# EAGLE design BBConnector (EAGLE 6.5.0)
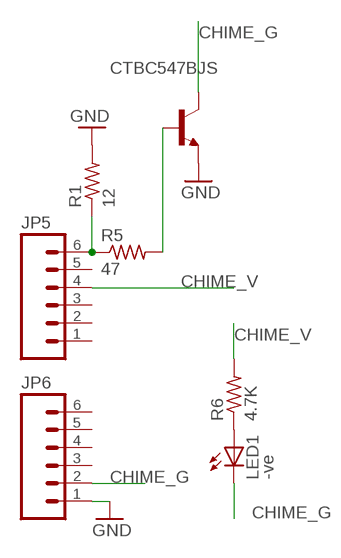
[diagram p0: schematic, sheet 1]

## Parts
CTBC547BJS  2N2222  [TO92-EBC-OVAL]
JP5  M06NO_SILK_YES_STOP  [1X06_NO_SILK_YES_STOP]
JP6  M06NO_SILK_YES_STOP  [1X06_NO_SILK_YES_STOP]
LED1  -ve  LEDCHIP-LED0603  [CHIP-LED0603]
R1  12  R-US_R0603  [R0603]
R5  47  R-US_R0603  [R0603]
R6  4.7K  R-US_R0603  [R0603]

## Nets
CHIME_G: CTBC547BJS.C JP6.2 LED1.C
CHIME_V: JP5.4 R6.2
GND: CTBC547BJS.E JP6.1 R1.2
N$1: JP5.6 R1.1 R5.1
N$2: LED1.A R6.1
N$3: CTBC547BJS.B R5.2
Unconnected: JP5.1 JP5.2 JP5.3 JP5.5 JP6.3 JP6.4 JP6.5 JP6.6

## Library data of the parts
CTBC547BJS = adafruit:2N2222: NPN TRANSISTOR Big oval pads
JP5 JP6 = SparkFun-Connectors:M06: Header 6 Standard 6-pin 0.1" header. Use with straight break away headers (SKU : PRT-00116), right angle break away headers (PRT-00553), swiss pins (PRT-00743), machine pins (PRT-00117), and female headers (PRT-00115). Molex polarized connector foot print use with SKU : PRT-08094 with associated crimp pins and housings. NOTES ON THE VARIANTS LOCK and LOCK_LONGPADS... This footprint was designed to help hold the alignment of a through-hole component (i.e. 6-pin header) while soldering it into place. You may notice that each hole has been shifted either up or down by 0.005 of an inch from it's more standard position (which is a perfectly straight line). This slight alteration caused the pins (the squares in the middle) to touch the edges of the holes. Because they are alternating, it causes a "brace" to hold the component in place. 0.005 has proven to be the perfect amount of "off-center" position when using our standard breakaway headers. Although looks a little odd when you look at the bare footprint, once you have a header in there, the alteration is very hard to notice. Also,if you push a header all the way into place, it is covered up entirely on the bottom side. This idea of altering the position of holes to aid alignment will be further integrated into the Sparkfun Library for other footprints. It can help hold any component with 3 or more connection pins.
LED1 = adafruit:LED: LED OSRAM: - CHIPLED LG R971, LG N971, LY N971, LG Q971, LY Q971, LO R971, LY R971 LH N974, LH R974 LS Q976, LO Q976, LY Q976 LO Q996 - Hyper CHIPLED LW Q18S LB Q993, LB Q99A, LB R99A - SideLED LS A670, LO A670, LY A670, LG A670, LP A670 LB A673, LV A673, LT A673, LW A673 LH A674 LY A675 LS A676, LA A676, LO A676, LY A676, LW A676 LS A679, LY A679, LG A679 - Hyper Micro SIDELED® LS Y876, LA Y876, LO Y876, LY Y876 LT Y87S - SmartLED LW L88C, LW L88S LB L89C, LB L89S, LG L890 LS L89K, LO L89K, LY L89K LS L896, LA L896, LO L896, LY L896 - TOPLED LS T670, LO T670, LY T670, LG T670, LP T670 LSG T670, LSP T670, LSY T670, LOP T670, LYG T670 LG T671, LOG T671, LSG T671 LB T673, LV T673, LT T673, LW T673 LH T674 LS T676, LA T676, LO T676, LY T676, LB T676, LH T676, LSB T676, LW T676 LB T67C, LV T67C, LT T67C, LS T67K, LO T67K, LY T67K, LW E67C LS E67B, LA E67B, LO E67B, LY E67B, LB E67C, LV E67C, LT E67C LW T67C LS T679, LY T679, LG T679 LS T770, LO T770, LY T770, LG T770, LP T770 LB T773, LV T773, LT T773, LW T773 LH T774 LS E675, LA E675, LY E675, LS T675 LS T776, LA T776, LO T776, LY T776, LB T776 LHGB T686 LT T68C, LB T68C - Hyper Mini TOPLED® LB M676 - Mini TOPLED Santana® LG M470 LS M47K, LO M47K, LY M47K Source: http://www.osram.convergy.de/
R1 R5 R6 = adafruit:R-US_: RESISTOR, American symbol

## Board
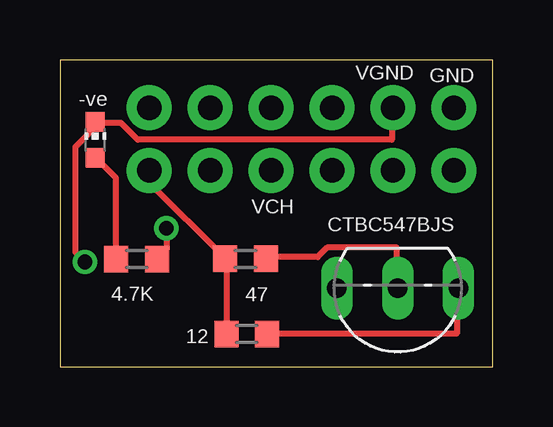
[diagram p1: board, top side]
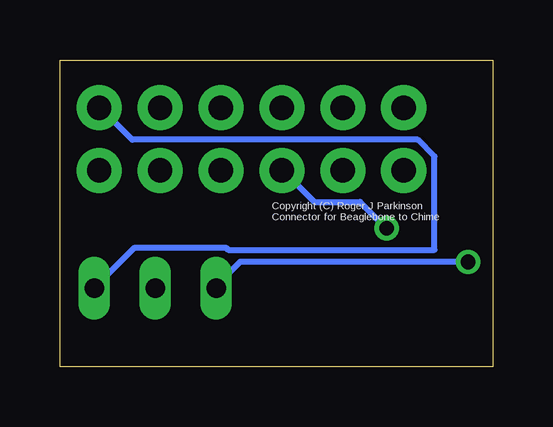
[diagram p2: board, bottom side, seen from below]

Size 18.06 x 12.8 mm. Coordinates in mm from the lower left corner, seen from the top.
Outline: 0,0 18.06,0.01 18.06,12.8 0,12.81 0,0
Copper layers (1*16): Top 0.035mm / dielectric 1.5mm / Bottom 0.035mm
Design rules "default": minimum track width 10mil, minimum drill 24mil, track to track 8mil, track to pad 8mil, pad to pad 8mil, via to via 8mil, smd to smd 8mil, copper to edge 40mil, drill to drill 8mil, minimum pad ring 10mil, minimum via ring 8mil, stop-mask expansion 4mil, vias tented up to drill 0mil, thermal gap 10mil

### Footprints (pad centres in the part's own frame; a part is rotated, then mirrored left to right if it is on the bottom)
TO92-EBC-OVAL = drill 0.813 long: B 0,-1.27; C 2.54,-1.27; E -2.54,-1.27
1X06_NO_SILK_YES_STOP = drill 1.016 pad 1.88: 1 0,0; 2 2.54,0; 3 5.08,0; 4 7.62,0; 5 10.16,0; 6 12.7,0
CHIP-LED0603 = smd 0.8 x 0.8: A 0,-0.75; C 0,0.75
R0603 = smd 1 x 1.1: 1 -0.85,0; 2 0.85,0

### Placement (x,y rotation side)
CTBC547BJS  14.08,2.02 180 top
JP5  16.43,8.2 180 top
JP6  16.43,10.81 180 top
LED1  1.47,9.47 0 top
R1  7.79,1.37 0 top
R5  7.74,4.51 0 top
R6  3.2,4.5 0 top

### Tracks (layer width: path | path; a pad name or v marks a point on that pad's centre or on a via)
CHIME_G  (via drill 0.61)
  Top 0.254: JP6.2 13.84,10.78 13.84,9.48 3.24,9.48 2.54,10.18 1.54,10.18 LED1.C 1.54,10.08 0.64,9.18 0.64,4.78 v1.04,4.38
  Bottom 0.254: v1.04,4.38 10.54,4.38 11.54,3.38 CTBC547BJS.C
CHIME_V  (via drill 0.61)
  Top 0.254: v4.44,5.78 4.44,4.88 4.14,4.58 R6.2
  Bottom 0.254: v4.44,5.78 5.54,6.88 7.44,6.88 8.74,8.18 JP5.4
GND
  Top 0.254: R1.2 16.54,1.38 16.54,3.28 CTBC547BJS.E
  Bottom 0.254: JP6.1 16.34,10.78 15.04,9.48 3.14,9.48 2.44,8.78 2.44,4.88 11.04,4.88 11.14,4.98 14.94,4.98 16.54,3.38 CTBC547BJS.E
N$1
  Top 0.254: R1.1 6.94,4.48 R5.1 6.84,4.58 3.74,7.68 3.74,8.18 JP5.6
N$2
  Top 0.254: LED1.A 1.54,8.68 2.34,7.88 2.34,4.58 R6.1
N$3
  Top 0.254: R5.2 8.64,4.58 10.74,4.58 11.14,4.98 14.04,4.98 14.04,3.38 CTBC547BJS.B

### Text on the board
tNames: VGND | GND | VCH
_bsilk: Copyright (C) Roger J Parkinson / Connector for Beaglebone to Chime